# EAGLE design LeafCanV001 (EAGLE 6.1)

## Sheet 1 of 3
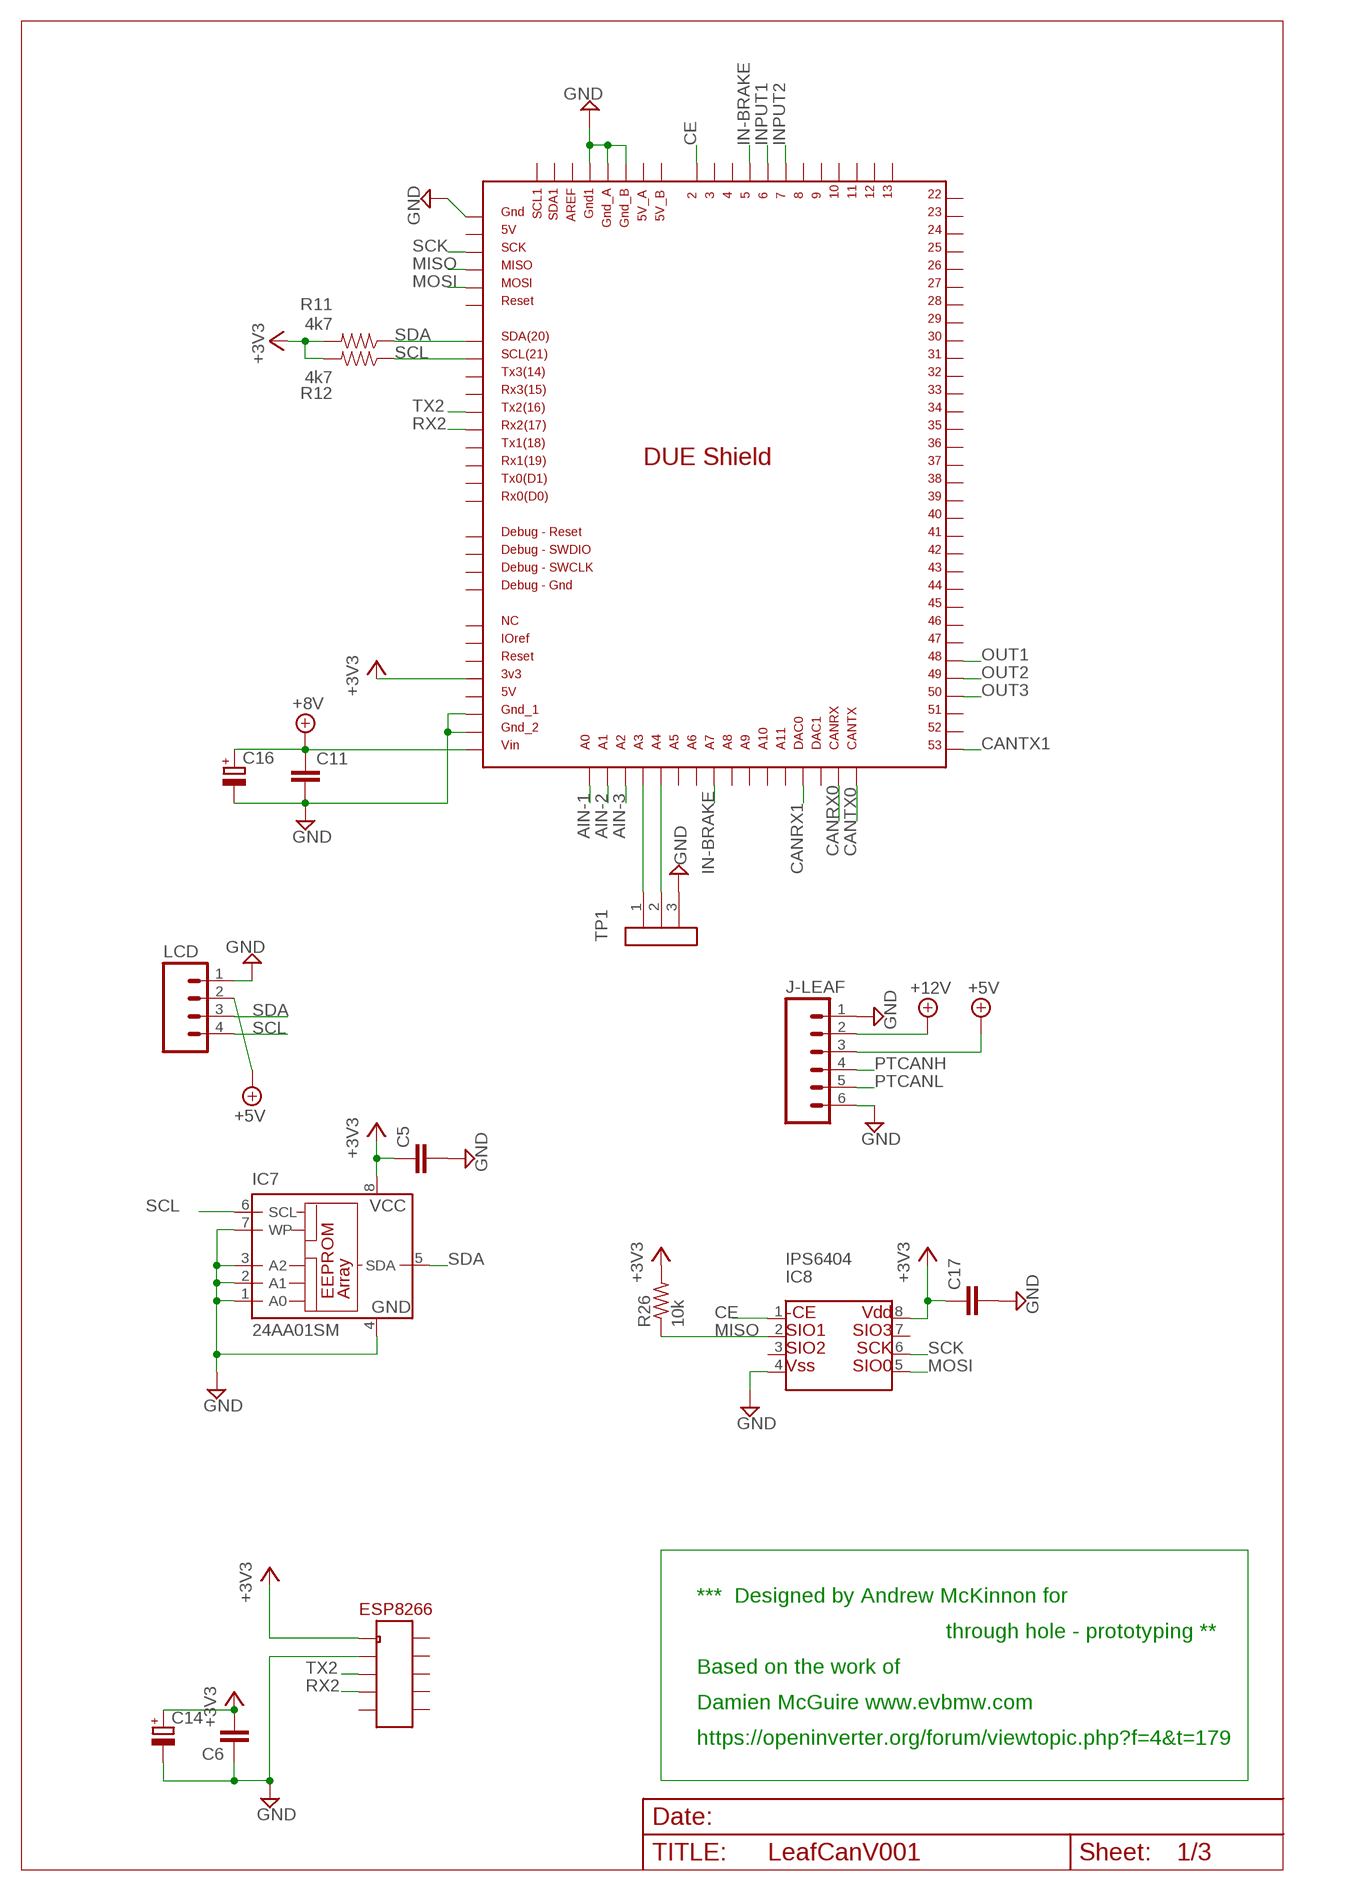
[diagram p0: schematic, sheet 1]

### Parts
C5  BCAP  [BCAP]
C6  BCAP  [BCAP]
C11  BCAP  [BCAP]
C14  C-RB200100  [CPOL-RADIAL-10UF-25V]
C16  C-RB200100  [CPOL-RADIAL-10UF-25V]
C17  BCAP  [BCAP]
ESP8266  IDC10  [IDC10-SMALL]
IC1  DUE(NORMAL)  [DUE(NORMAL)]
IC7  24AA01SM  [SO-08M]
IC8  IPS6404  [SO-08]
J-LEAF  MO6POL  [MOLEX-6]
LCD  MO4POL  [MOLEX-4]
R11  4k7  R4  [AXIAL-0.4]
R12  4k7  R4  [AXIAL-0.4]
R26  10k  R-US_R1206  [R1206]
TP1  SIL3  [SIL3]

### Nets
+3V3: C5.1 C6.2 C14.1(+) C17.1 ESP8266.1 IC1.3V3 IC7.8(VCC) IC8.8 R11.P$2 R12.P$2 R26.2 ; also sheet 2,3
+5V: J-LEAF.3 LCD.2 ; also sheet 3
+8V: C11.1 C16.1(+) IC1.VIN ; also sheet 3
+12V: J-LEAF.2 ; also sheet 2,3
AIN-1: IC1.A0 ; also sheet 3
AIN-2: IC1.A1 ; also sheet 3
AIN-3: IC1.A2 ; also sheet 3
CANRX0: IC1.CANRX ; also sheet 3
CANRX1: IC1.DAC0 ; also sheet 3
CANTX0: IC1.CANTX ; also sheet 3
CANTX1: IC1.53 ; also sheet 3
CE: IC1.2 IC8.1
GND: C5.2 C6.1 C11.2 C14.2(-) C16.2(-) C17.2 ESP8266.3 IC1.5V_ICSP IC1.GND1 IC1.GND_1 IC1.GND_2 IC1.GND_A IC1.GND_B IC7.1(A0) IC7.2(A1) IC7.3(A2) IC7.4(GND) IC7.7(WP) IC8.4 J-LEAF.1 J-LEAF.6 LCD.1 TP1.3 ; also sheet 2,3
IN-BRAKE: IC1.5 IC1.A7 ; also sheet 2
INPUT1: IC1.6 ; also sheet 2
INPUT2: IC1.7 ; also sheet 2
MISO: IC1.MISO_ICSP IC8.2 R26.1
MOSI: IC1.MOSI_ICSP IC8.5
N$20: IC1.A3 TP1.1
N$21: IC1.A4 TP1.2
OUT1: IC1.48 ; also sheet 2
OUT2: IC1.49 ; also sheet 2
OUT3: IC1.50 ; also sheet 2
PTCANH: J-LEAF.4 ; also sheet 3
PTCANL: J-LEAF.5 ; also sheet 3
RX2: ESP8266.7 IC1.RX2
SCK: IC1.SCK_ICSP IC8.6
SCL: IC1.SCL IC7.6(SCL) LCD.4 R12.P$1
SDA: IC1.SDA IC7.5(SDA) LCD.3 R11.P$1
TX2: ESP8266.5 IC1.TX2
Unconnected: ESP8266.2 ESP8266.4 ESP8266.6 ESP8266.8 ESP8266.9 ESP8266.10 IC1.3 IC1.4 IC1.5V IC1.5V_A IC1.5V_B IC1.8 IC1.9 IC1.10 IC1.11 IC1.12 IC1.13 IC1.22 IC1.23 IC1.24 IC1.25 IC1.26 IC1.27 IC1.28 IC1.29 IC1.30 IC1.31 IC1.32 IC1.33 IC1.34 IC1.35 IC1.36 IC1.37 IC1.38 IC1.39 IC1.40 IC1.41 IC1.42 IC1.43 IC1.44 IC1.45 IC1.46 IC1.47 IC1.51 IC1.52 IC1.A5 IC1.A6 IC1.A8 IC1.A9 IC1.A10 IC1.A11 IC1.AREF IC1.DAC1 IC1.GND_DEBUG IC1.GND_ICSP IC1.IOREF IC1.NC IC1.RESET IC1.RESET_DEBUG IC1.RESET_ICSP IC1.RX0 IC1.RX1 IC1.RX3 IC1.SCL1 IC1.SDA1 IC1.SWCLK_DEBUG IC1.SWDIO_DEBUG IC1.TX0 IC1.TX1 IC1.TX3 IC8.3 IC8.7

### Notes on the sheet
- ***  Designed by Andrew McKinnon for
- through hole - prototyping **
- Based on the work of
- Damien McGuire www.evbmw.com
- https://openinverter.org/forum/viewtopic.php?f=4&t=179

## Sheet 2 of 3
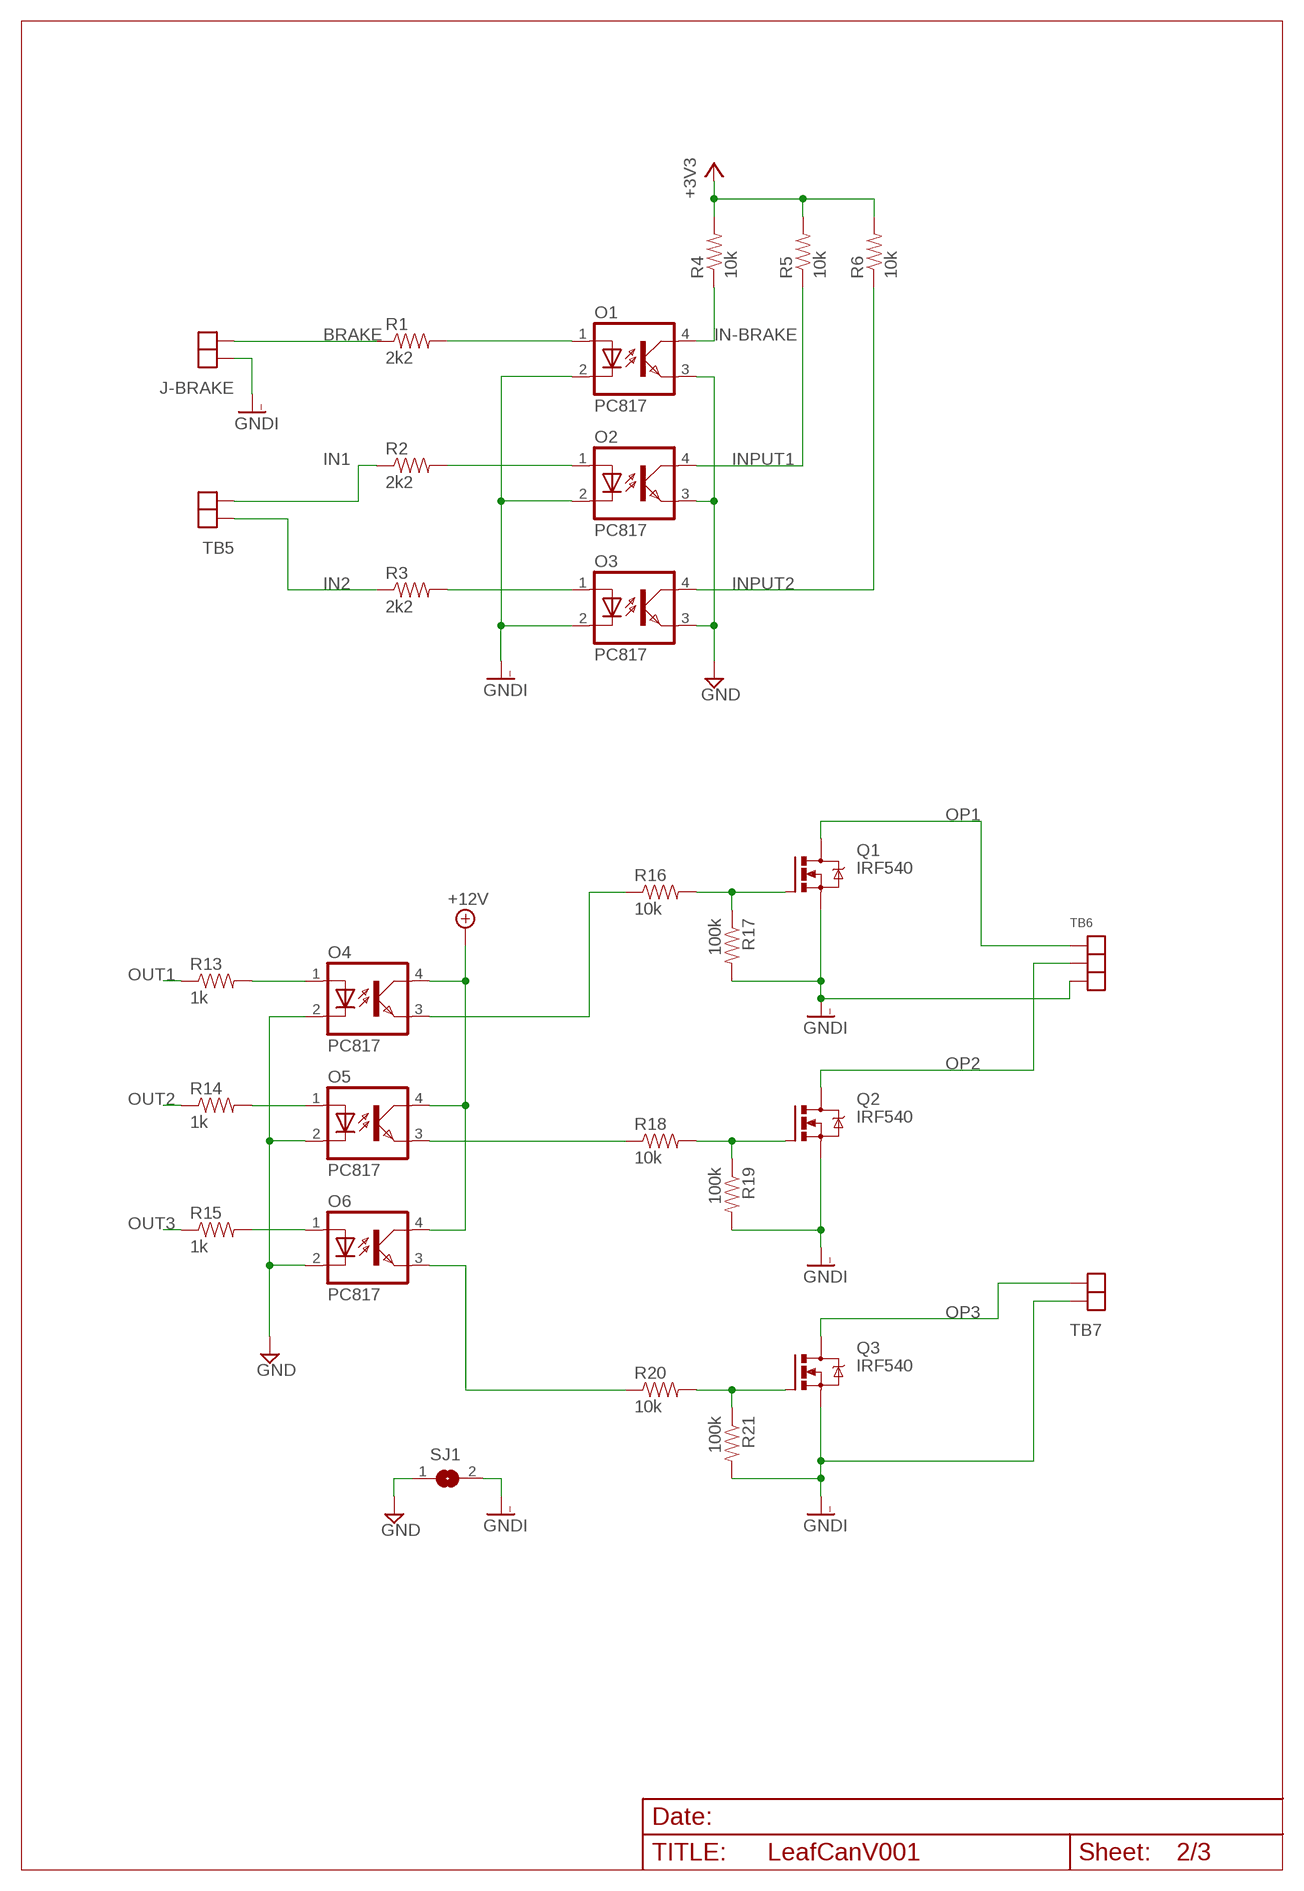
[diagram p1: schematic, sheet 2]

### Parts
J-BRAKE  TB2381  [TB-KF2EDG381-2P]
O1  PC817  [DIL04]
O2  PC817  [DIL04]
O3  PC817  [DIL04]
O4  PC817  [DIL04]
O5  PC817  [DIL04]
O6  PC817  [DIL04]
Q1  IRF540  [TO220BV]
Q2  IRF540  [TO220BV]
Q3  IRF540  [TO220BV]
R1  2k2  R4  [AXIAL-0.4]
R2  2k2  R4  [AXIAL-0.4]
R3  2k2  R4  [AXIAL-0.4]
R4  10k  R4  [AXIAL-0.4]
R5  10k  R4  [AXIAL-0.4]
R6  10k  R4  [AXIAL-0.4]
R13  1k  R4  [AXIAL-0.4]
R14  1k  R4  [AXIAL-0.4]
R15  1k  R4  [AXIAL-0.4]
R16  10k  R4  [AXIAL-0.4]
R17  100k  R4  [AXIAL-0.4]
R18  10k  R4  [AXIAL-0.4]
R19  100k  R4  [AXIAL-0.4]
R20  10k  R4  [AXIAL-0.4]
R21  100k  R4  [AXIAL-0.4]
SJ1  SJ  [SJ]
TB5  TB2381  [TB-KF2EDG381-2P]
TB6  TB3381  [TB-KF2EDG381-3P]
TB7  TB2381  [TB-KF2EDG381-2P]

### Nets
+3V3: R4.P$2 R5.P$2 R6.P$2 ; also sheet 1,3
+12V: O4.4(COL) O5.4(COL) O6.4(COL) ; also sheet 1,3
BRAKE: J-BRAKE.1 R1.P$1
GND: O1.3(EMIT) O2.3(EMIT) O3.3(EMIT) O4.2(C) O5.2(C) O6.2(C) SJ1.1 ; also sheet 1,3
GNDI: J-BRAKE.2 O1.2(C) O2.2(C) O3.2(C) Q1.S Q2.S Q3.S R17.P$2 R19.P$2 R21.P$2 SJ1.2 TB6.3 TB7.2
IN1: R2.P$1 TB5.1
IN2: R3.P$1 TB5.2
IN-BRAKE: O1.4(COL) R4.P$1 ; also sheet 1
INPUT1: O2.4(COL) R5.P$1 ; also sheet 1
INPUT2: O3.4(COL) R6.P$1 ; also sheet 1
N$1: Q1.G R16.P$2 R17.P$1
N$2: O3.1(A) R3.P$2
N$3: O2.1(A) R2.P$2
N$4: O1.1(A) R1.P$2
N$11: Q2.G R18.P$2 R19.P$1
N$12: Q3.G R20.P$2 R21.P$1
N$13: O4.1(A) R13.P$2
N$14: O5.1(A) R14.P$2
N$15: O6.1(A) R15.P$2
N$16: O6.3(EMIT) R20.P$1
N$17: O5.3(EMIT) R18.P$1
N$18: O4.3(EMIT) R16.P$1
OP1: Q1.D TB6.1
OP2: Q2.D TB6.2
OP3: Q3.D TB7.1
OUT1: R13.P$1 ; also sheet 1
OUT2: R14.P$1 ; also sheet 1
OUT3: R15.P$1 ; also sheet 1

## Sheet 3 of 3
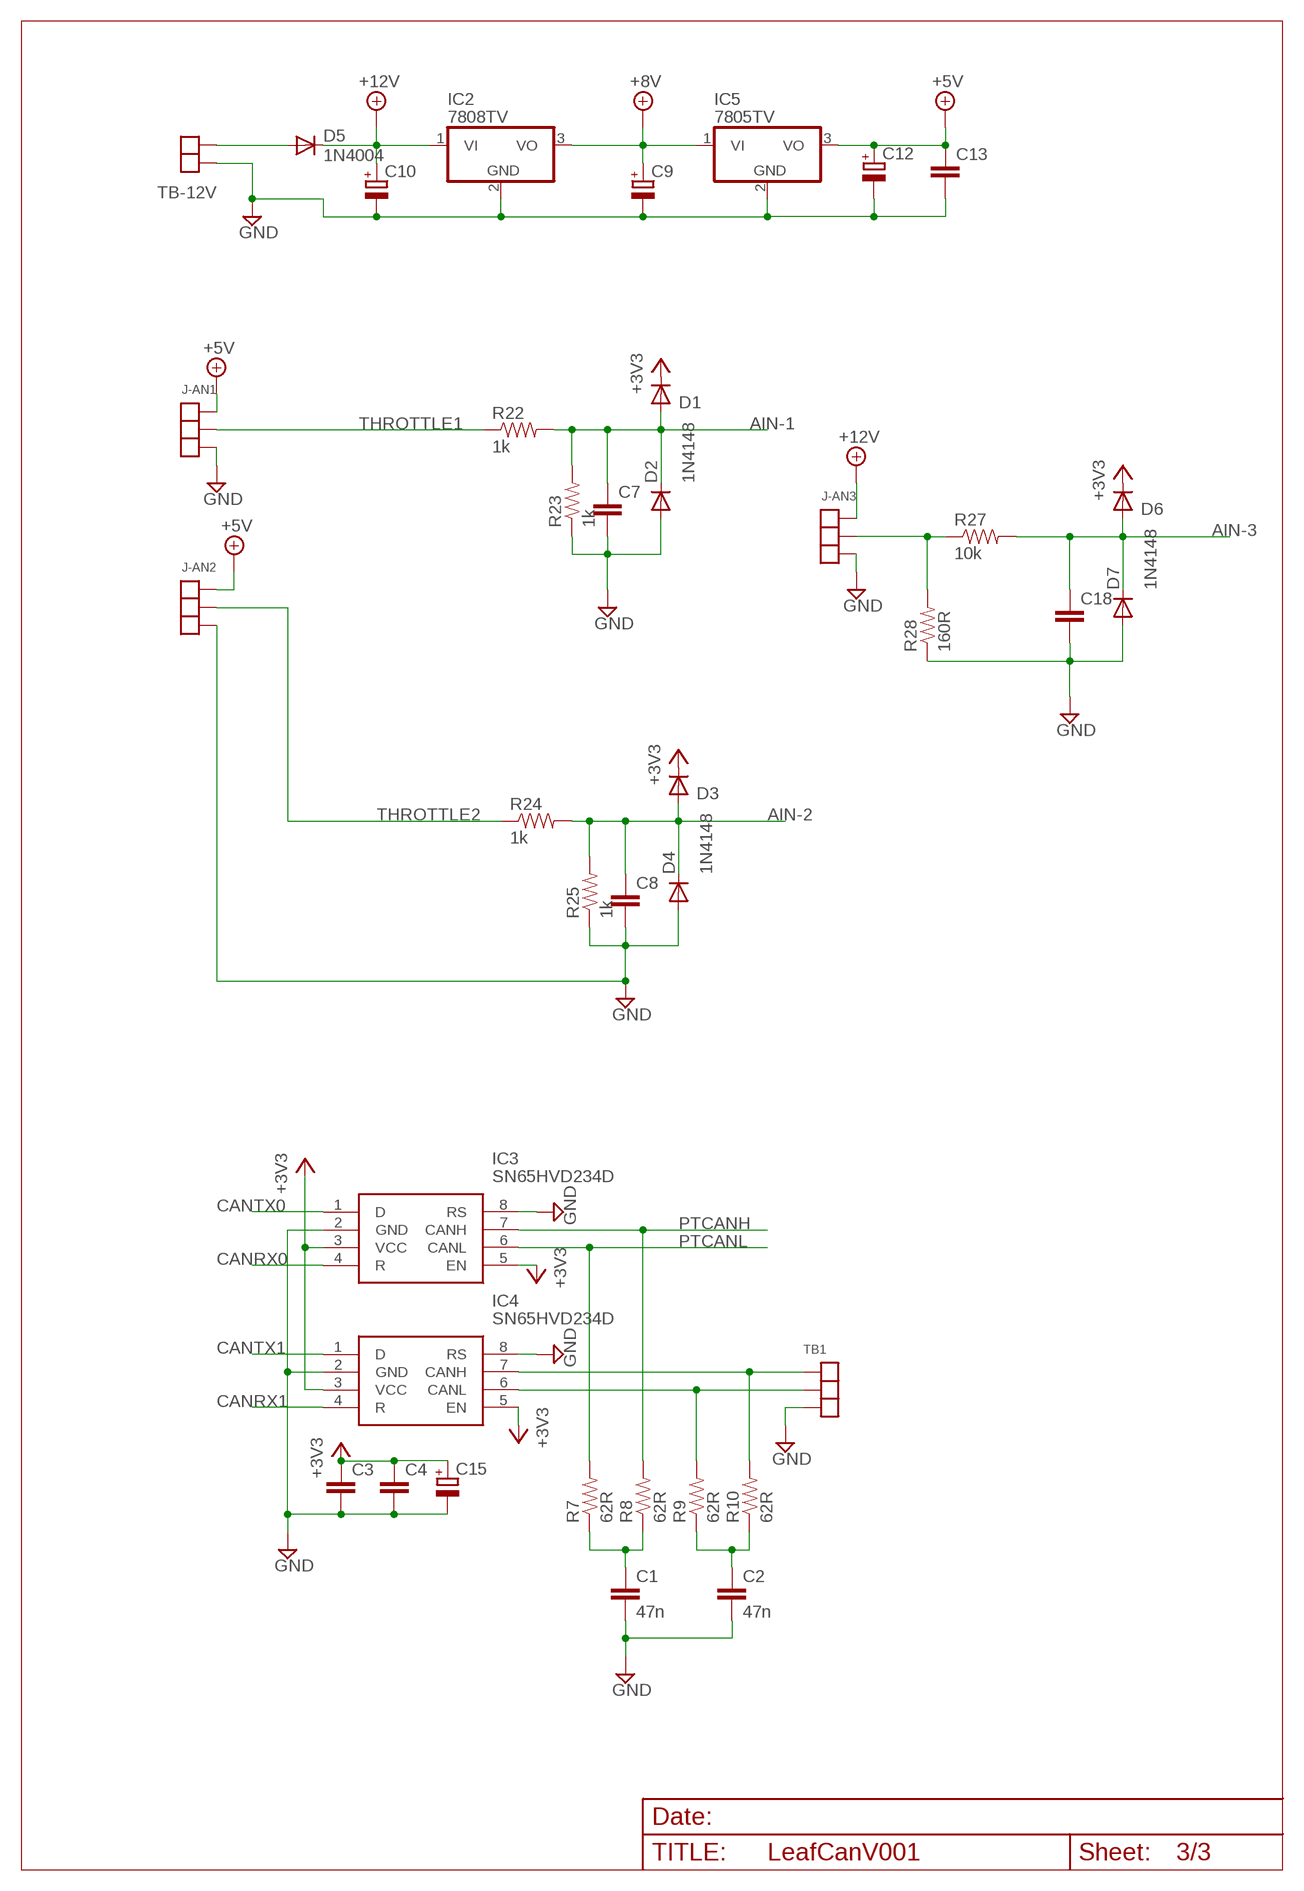
[diagram p2: schematic, sheet 3]

### Parts
C1  47n  C-EU025-030X050  [C025-030X050]
C2  47n  C-EU025-030X050  [C025-030X050]
C3  BCAP  [BCAP]
C4  BCAP  [BCAP]
C7  BCAP  [BCAP]
C8  BCAP  [BCAP]
C9  C-RB200100  [CPOL-RADIAL-10UF-25V]
C10  CPOL-EUE7.5-18  [E7,5-18]
C12  C-RB200100  [CPOL-RADIAL-10UF-25V]
C13  BCAP  [BCAP]
C15  C-RB200100  [CPOL-RADIAL-10UF-25V]
C18  BCAP  [BCAP]
D1  1N4148  1N4148DO35-7  [D3]
D2  1N4148  1N4148DO35-7  [D3]
D3  1N4148  1N4148DO35-7  [D3]
D4  1N4148  1N4148DO35-7  [D3]
D5  1N4004  [DO41-10]
D6  1N4148  1N4148DO35-7  [D3]
D7  1N4148  1N4148DO35-7  [D3]
IC2  7808TV  [TO220V]
IC3  SN65HVD234D  [SOIC127P600X175-8N]
IC4  SN65HVD234D  [SOIC127P600X175-8N]
IC5  7805TV  [TO220V]
J-AN1  TB3381V  [TB-KF2EDG381-3-V]
J-AN2  TB3381V  [TB-KF2EDG381-3-V]
J-AN3  TB3381V  [TB-KF2EDG381-3-V]
R7  62R  R4  [AXIAL-0.4]
R8  62R  R4  [AXIAL-0.4]
R9  62R  R4  [AXIAL-0.4]
R10  62R  R4  [AXIAL-0.4]
R22  1k  R4  [AXIAL-0.4]
R23  1k  R4  [AXIAL-0.4]
R24  1k  R4  [AXIAL-0.4]
R25  1k  R4  [AXIAL-0.4]
R27  10k  R4  [AXIAL-0.4]
R28  160R  R4  [AXIAL-0.4]
TB1  TB3381V  [TB-KF2EDG381-3-V]
TB-12V  TB2381  [TB-KF2EDG381-2P]

### Nets
+3V3: C3.1 C4.1 C15.1(+) D1.C D3.C D6.C IC3.3(VCC) IC3.5(EN) IC4.3(VCC) IC4.5(EN) ; also sheet 1,2
+5V: C12.1(+) C13.1 IC5.3(VO) J-AN1.1 J-AN2.1 ; also sheet 1
+8V: C9.1(+) IC2.3(VO) IC5.1(VI) ; also sheet 1
+12V: C10.+ D5.C IC2.1(VI) J-AN3.1 ; also sheet 1,2
AIN-1: C7.1 D1.A D2.C R22.P$2 R23.P$2 ; also sheet 1
AIN-2: C8.1 D3.A D4.C R24.P$2 R25.P$2 ; also sheet 1
AIN-3: C18.1 D6.A D7.C R27.P$2 ; also sheet 1
CANRX0: IC3.4(R) ; also sheet 1
CANRX1: IC4.4(R) ; also sheet 1
CANTX0: IC3.1(D) ; also sheet 1
CANTX1: IC4.1(D) ; also sheet 1
GND: C1.2 C2.2 C3.2 C4.2 C7.2 C8.2 C9.2(-) C10.- C12.2(-) C13.2 C15.2(-) C18.2 D2.A D4.A D7.A IC2.2(GND) IC3.2(GND) IC3.8(RS) IC4.2(GND) IC4.8(RS) IC5.2(GND) J-AN1.3 J-AN2.3 J-AN3.3 R23.P$1 R25.P$1 R28.P$1 TB1.3 TB-12V.2 ; also sheet 1,2
N$5: C1.1 R7.P$1 R8.P$1
N$6: C2.1 R9.P$1 R10.P$1
N$8: J-AN3.2 R27.P$1 R28.P$2
N$9: IC4.7(CANH) R10.P$2 TB1.1
N$10: IC4.6(CANL) R9.P$2 TB1.2
N$19: D5.A TB-12V.1
PTCANH: IC3.7(CANH) R8.P$2 ; also sheet 1
PTCANL: IC3.6(CANL) R7.P$2 ; also sheet 1
THROTTLE1: J-AN1.2 R22.P$1
THROTTLE2: J-AN2.2 R24.P$1

## Library data of the parts
C1 C2 = rcl:C-EU: CAPACITOR, European symbol
C3-C8 C11 C13 C17 C18 = Andrew Misc:BCAP
C9 C12 = Andrew:C-RB200100
C10 = rcl:CPOL-EU: POLARIZED CAPACITOR, European symbol
C14-C16 = Andrew Passive:C-RB200100
D1-D4 D6 D7 = Andrew Misc:1N4148: DIODE high speed (Philips)
D5 = diode:1N4004: DIODE general purpose rectifier, 1 A
ESP8266 = Andrew_Connectors:IDC10
IC1 = DUElib130425:DUE(NORMAL)
IC2 IC5 = Andrew Linear:78*: Positive VOLTAGE REGULATOR Source: http://cache.national.com/ds/LM/LM78L05.pdf http://www.fairchildsemi.com/ds/LM/LM7805.pdf
IC3 IC4 = SN65HVD234D:SN65HVD234D: 3.3 V CAN Transceiver with Sleep Mode Source: Datasheet <http://www.ti.com/lit/gpn/sn65hvd234>; DESCRIPTION: 3.3 V CAN Transceiver with Sleep Mode; HEIGHT: 1.75mm; MANUFACTURER_NAME: Texas Instruments; MANUFACTURER_PART_NUMBER: SN65HVD234D; MOUSER_PART_NUMBER: 595-SN65HVD234D; MOUSER_PRICE-STOCK: https://www.mouser.com/Search/Refine.aspx?Keyword=595-SN65HVD234D; RS_PART_NUMBER: 6624315P; RS_PRICE-STOCK: http://uk.rs-online.com/web/p/products/6624315P
IC7 = microchip:24*: Serial EEPROM I2C; MF: MICROCHIP; MPN: 24AA01-I/SN; OC_FARNELL: 1331268; OC_NEWARK: 92C6793
IC8 = Andrew IC:IPS6404
J-AN1-J-AN3 TB1 TB6 = Andrew_Connectors:TB3
J-BRAKE TB5 TB7 TB-12V = Andrew_Connectors:TB2
J-LEAF = Andrew_Connectors:MO6POL
LCD = Andrew_Connectors:MO4POL
O1-O6 = Andrew:PC817: SHARP OPTO COUPLER; MPN: PC817X4J000F; OC_FARNELL: 9707727; OC_NEWARK: 97K7059
Q1-Q3 = Andrew Misc:IRF540: HEXFET Power MOSFET
R1-R25 R27 R28 = Andrew Misc:R4
R26 = rcl:R-US_: RESISTOR, American symbol
SJ1 = jumper:SJ: SMD solder JUMPER
TP1 = Andrew_Connectors:SIL3

## Board
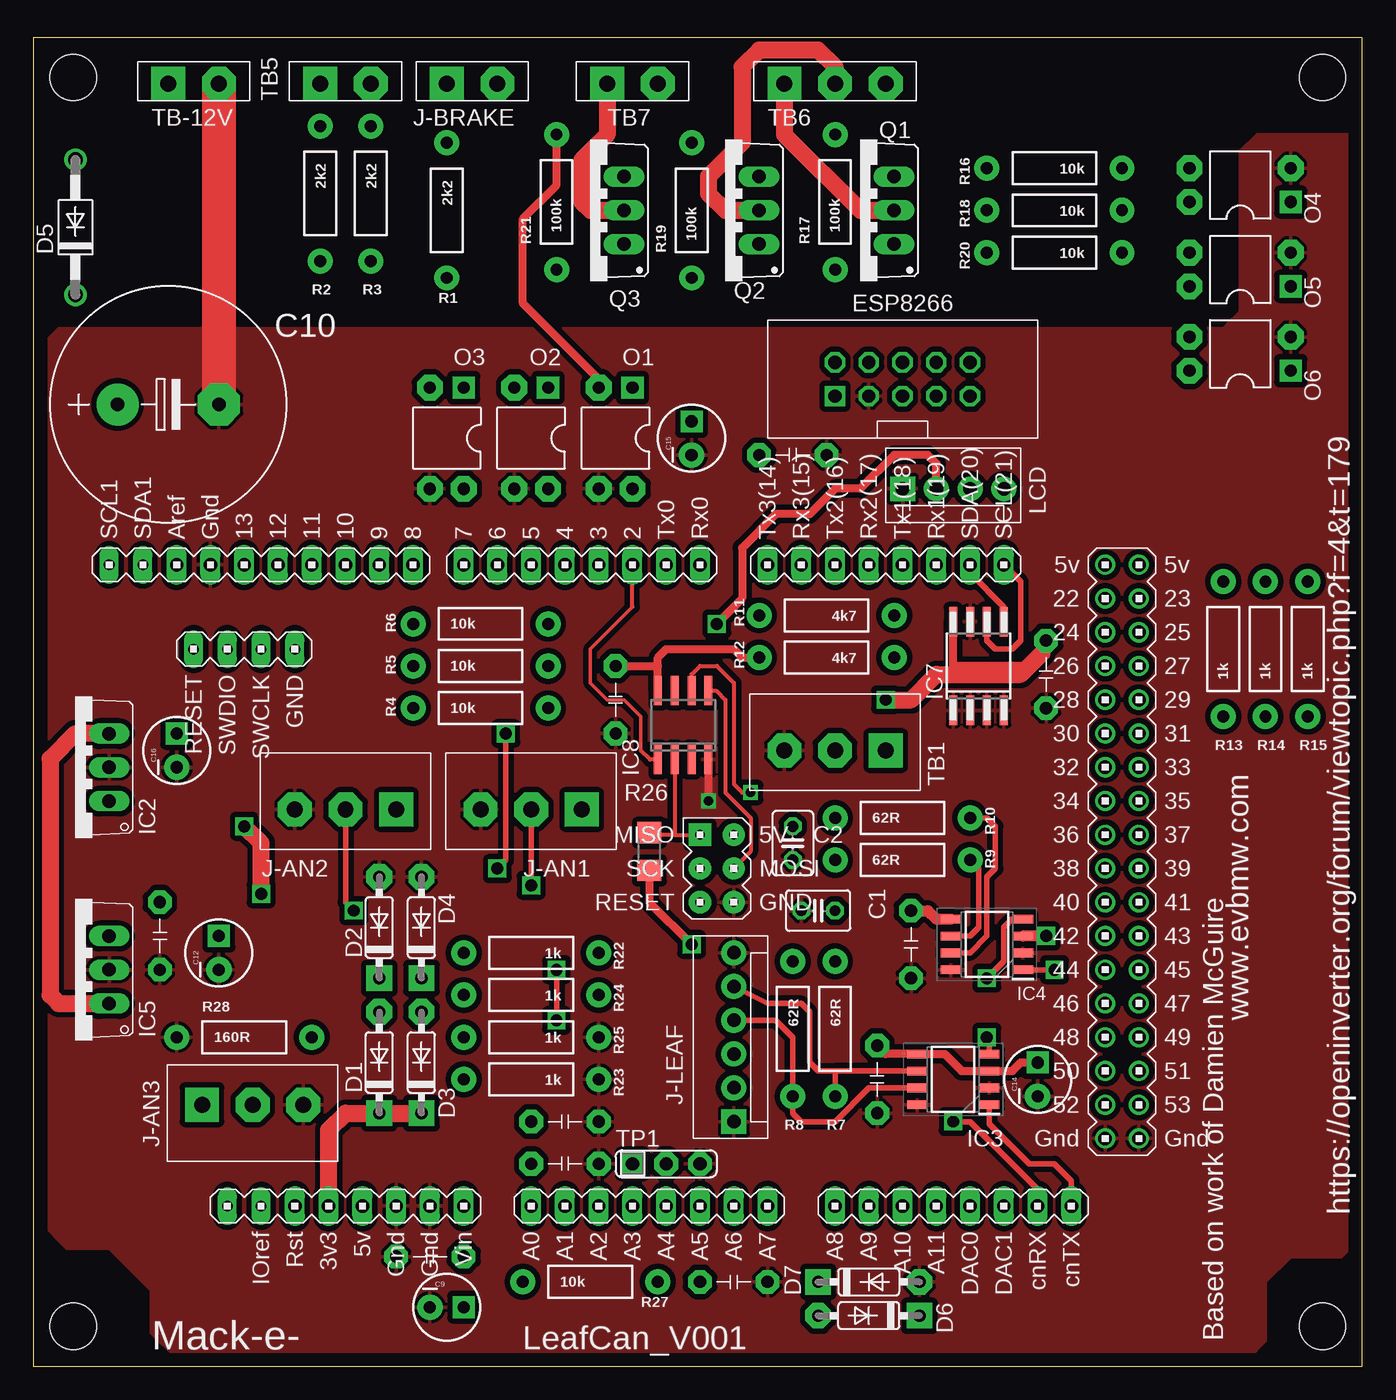
[diagram p3: board, top side]
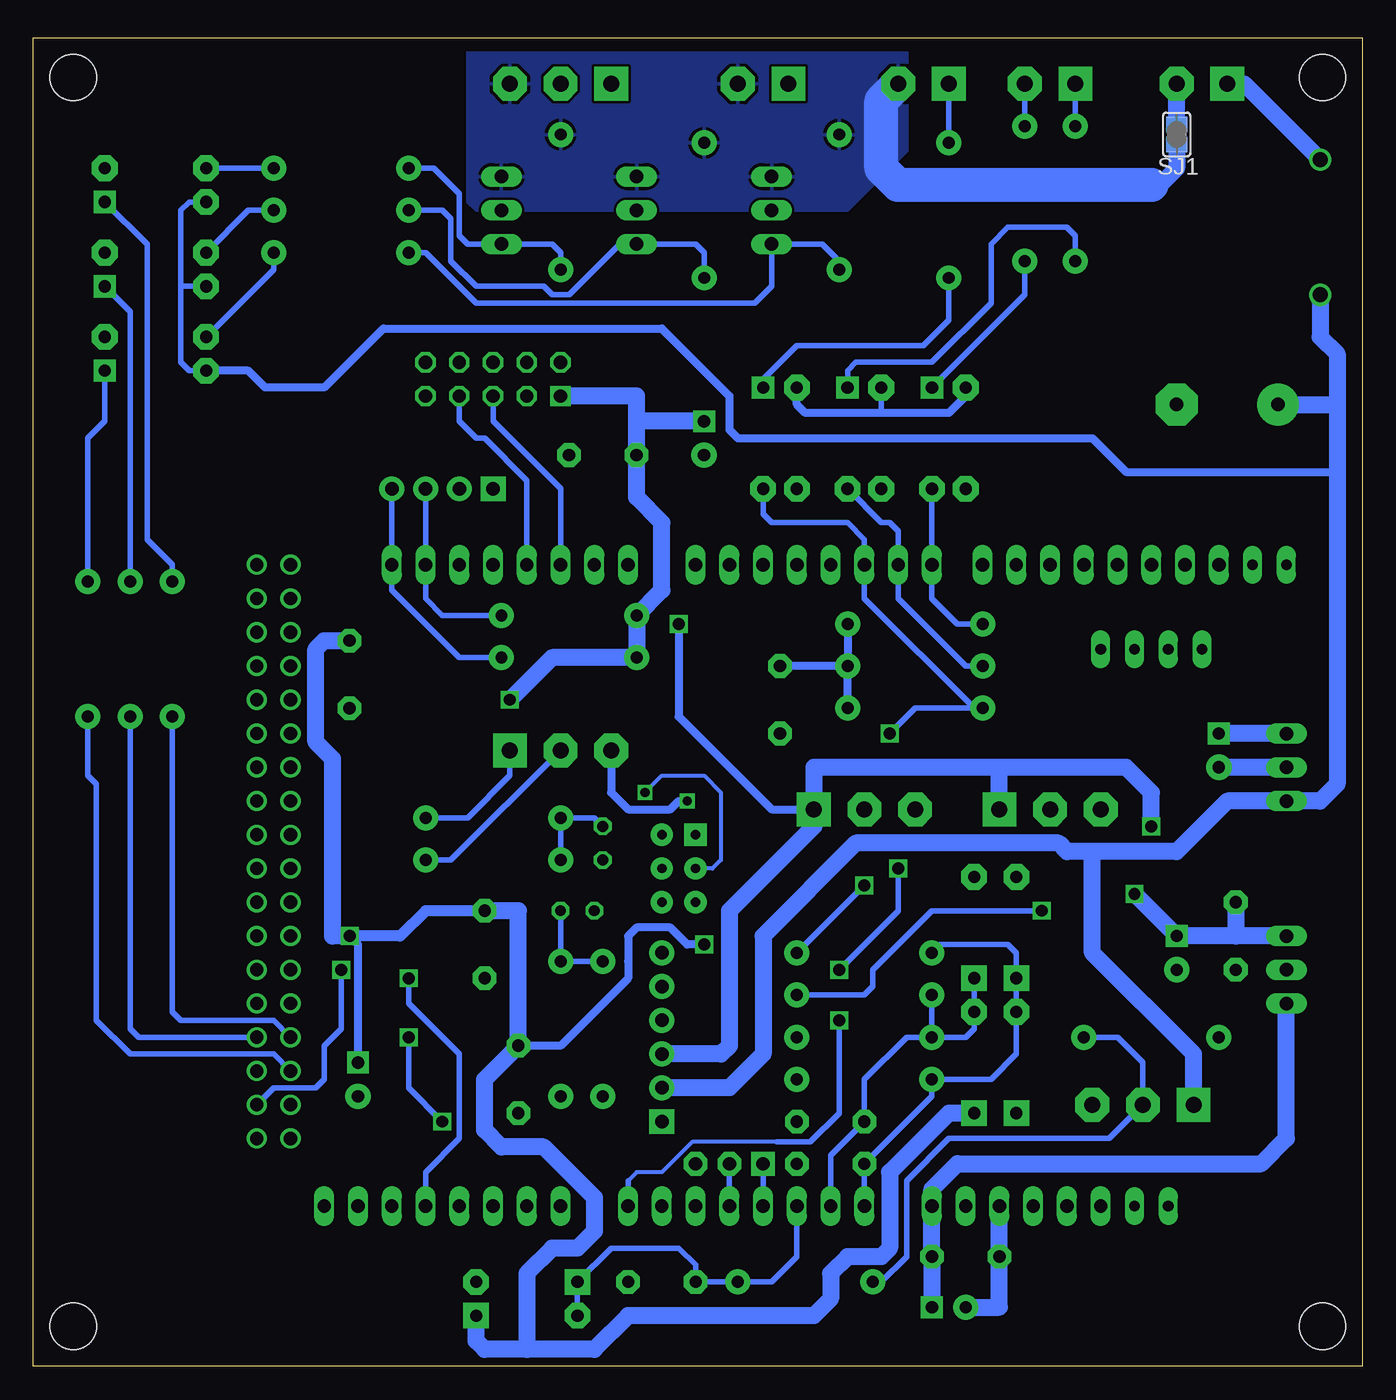
[diagram p4: board, bottom side, seen from below]

Size 100 x 100 mm. Coordinates in mm from the lower left corner, seen from the top.
Outline: 0,0 100,0 100,100 0,100 0,0
Copper layers (1*16): Top 0.035mm / dielectric 1.5mm / Bottom 0.035mm
Design rules: minimum track width 10mil, minimum drill 24mil, track to track 8mil, track to pad 8mil, pad to pad 8mil, via to via 8mil, smd to smd 8mil, copper to edge 40mil, drill to drill 8mil, minimum pad ring 10mil, minimum via ring 8mil, stop-mask expansion 4mil, vias tented up to drill 0mil, thermal gap 10mil
Holes 3.5 mm at 3,3 3,97 97,97 97,3

### Footprints (pad centres in the part's own frame; a part is rotated, then mirrored left to right if it is on the bottom)
C025-030X050 = drill 0.813 octagon: 1 -1.27,0; 2 1.27,0
BCAP = drill 0.914 pad 1.778 octagon: 1 -2.54,0; 2 2.54,0
CPOL-RADIAL-10UF-25V = drill 0.914 pad 1.651 square: 1 1.27,0 | drill 0.914 pad 1.905: 2 -1.27,0
E7,5-18 = drill 1.016 pad 3.15: + -3.81,0 | drill 1.016 pad 3.15 octagon: - 3.81,0
D3 = drill 0.914 pad 1.93 octagon: A 3.81,0 | drill 0.914 pad 1.93 square: C -3.81,0
DO41-10 = drill 1.118: A 5.08,0; C -5.08,0
IDC10-SMALL = drill 1 pad 1.524 square: 1 -5.08,-1.27 | drill 1 pad 1.524 octagon: 2 -5.08,1.27; 3 -2.54,-1.27; 4 -2.54,1.27; 5 0,-1.27; 6 0,1.27; 7 2.54,-1.27; 8 2.54,1.27; 9 5.08,-1.27; 10 5.08,1.27
DUE(NORMAL) = drill 1 long: 2 -16.51,30.48; 3 -19.05,30.48; 3V3 -39.37,-17.78; 4 -21.59,30.48; 5 -24.13,30.48; 5V -36.83,-17.78; 6 -26.67,30.48; 7 -29.21,30.48; 8 -33.02,30.48; 9 -35.56,30.48; 10 -38.1,30.48; 11 -40.64,30.48; 12 -43.18,30.48; 13 -45.72,30.48; A0 -24.13,-17.78; A1 -21.59,-17.78; A2 -19.05,-17.78; A3 -16.51,-17.78; A4 -13.97,-17.78; A5 -11.43,-17.78; A6 -8.89,-17.78; A7 -6.35,-17.78; A8 -1.27,-17.78; A9 1.27,-17.78; A10 3.81,-17.78; A11 6.35,-17.78; AREF -50.8,30.48; AREF1 -50.8,30.48; CANRX 13.97,-17.78; CANTX 16.51,-17.78; DAC0 8.89,-17.78; DAC1 11.43,-17.78; GND1 -48.26,30.48; GND_1 -34.29,-17.78; GND_2 -31.75,-17.78; RESET -41.91,-17.78; RX0 -11.43,30.48; RX1 6.35,30.48; RX2 1.27,30.48; RX3 -3.81,30.48; SCL 11.43,30.48; SDA 8.89,30.48; TX0 -13.97,30.48; TX1 3.81,30.48; TX2 -1.27,30.48; TX3 -6.35,30.48; VIN -29.21,-17.78 | drill 1: 5V_A 19.05,30.48; 5V_B 21.59,30.48; 22 19.05,27.94; 23 21.59,27.94; 24 19.05,25.4; 25 21.59,25.4; 26 19.05,22.86; 27 21.59,22.86; 28 19.05,20.32; 29 21.59,20.32; 30 19.05,17.78; 31 21.59,17.78; 32 19.05,15.24; 33 21.59,15.24; 34 19.05,12.7; 35 21.59,12.7; 36 19.05,10.16; 37 21.59,10.16; 38 19.05,7.62; 39 21.59,7.62; 40 19.05,5.08; 41 21.59,5.08; 42 19.05,2.54; 43 21.59,2.54; 44 19.05,0; 45 21.59,0; 46 19.05,-2.54; 47 21.59,-2.54; 48 19.05,-5.08; 49 21.59,-5.08; 50 19.05,-7.62; 51 21.59,-7.62; 52 19.05,-10.16; 53 21.59,-10.16; GND_A 19.05,-12.7; GND_B 21.59,-12.7 | drill 0.7 pad 1.676: 5V_ICSP -8.89,5.08; GND_ICSP -8.89,10.16; MOSI_ICSP -8.89,7.62; RESET_ICSP -11.43,5.08; SCK_ICSP -11.43,7.62 | drill 0.8 pad 1.422 long: GND_DEBUG -41.91,24.13; IOREF -44.45,-17.78; NC -46.99,-17.78; RESET_DEBUG -49.53,24.13; SCL1 -55.88,30.48; SDA1 -53.34,30.48; SWCLK_DEBUG -44.45,24.13; SWDIO_DEBUG -46.99,24.13 | drill 0.7 pad 1.676 square: MISO_ICSP -11.43,10.16
TO220V = drill 1.016 long: 1 -2.54,-2.54; 2 0,-2.54; 3 2.54,-2.54
SOIC127P600X175-8N = smd 1.528 x 0.65: 1 -2.711,1.905; 2 -2.711,0.635; 3 -2.711,-0.635; 4 -2.711,-1.905; 5 2.711,-1.905; 6 2.711,-0.635; 7 2.711,0.635; 8 2.711,1.905
SO-08M = smd 0.6 x 2.2: 1 -1.905,-3.33; 2 -0.635,-3.33; 3 0.635,-3.33; 4 1.905,-3.33; 5 1.905,3.33; 6 0.635,3.33; 7 -0.635,3.33; 8 -1.905,3.33
SO-08 = smd 0.6 x 2.2: 1 -1.905,-2.6; 2 -0.635,-2.6; 3 0.635,-2.6; 4 1.905,-2.6; 5 1.905,2.6; 6 0.635,2.6; 7 -0.635,2.6; 8 -1.905,2.6
TB-KF2EDG381-3-V = drill 1.2 pad 2.54 square: 1 0,0 | drill 1.2 pad 2.54 octagon: 2 3.81,0; 3 7.62,0
TB-KF2EDG381-2P = drill 1.2 pad 2.54 square: 1 0,0 | drill 1.2 pad 2.54 octagon: 2 3.81,0
MOLEX-6 = drill 1.016 pad 1.88 square: 1 -6.35,0 | drill 1.016 pad 1.88: 2 -3.81,0; 3 -1.27,0; 4 1.27,0; 5 3.81,0; 6 6.35,0
MOLEX-4 = drill 1.016 pad 1.88 square: 1 -3.81,0 | drill 1.016 pad 1.88: 2 -1.27,0; 3 1.27,0; 4 3.81,0
DIL04 = drill 0.914 pad 1.676 square: 1 -1.27,-3.81 | drill 0.914 pad 1.93 octagon: 2 1.27,-3.81; 3 1.27,3.81; 4 -1.27,3.81
TO220BV = drill 1.016 long: D 0,-2.54; G -2.54,-2.54; S 2.54,-2.54
AXIAL-0.4 = drill 0.9 pad 1.88: P$1 -5.08,0; P$2 5.08,0
R1206 = smd 1.6 x 1.803: 1 -1.422,0; 2 1.422,0
SJ = smd 1.168 x 1.6: 1 -0.762,0; 2 0.762,0
TB-KF2EDG381-3P = drill 1.2 pad 2.54 square: 1 0,0 | drill 1.2 pad 2.54 octagon: 2 3.81,0; 3 7.62,0
SIL3 = drill 1 pad 1.778 square: 1 0,0 | drill 1 pad 1.778 octagon: 2 2.54,0; 3 5.08,0

### Placement (x,y rotation side)
C1  59.05,34.29 180 top
C2  57.15,39.37 270 top
C3  57.15,68.58 0 top
C4  66.04,31.75 270 top
C5  76.2,52.07 270 top
C6  63.5,21.59 90 top
C7  40.01,15.24 0 top
C8  40.01,18.41 0 top
C9  31.11,4.45 0 top
C10  10.16,72.39 0 top
C11  29.84,8.26 180 top
C12  13.97,31.11 90 top
C13  9.53,32.38 270 top
C14  75.56,21.59 90 top
C15  49.53,69.85 90 top
C16  10.79,46.35 90 top
C17  43.81,50.16 270 top
C18  52.7,6.35 0 top
D1  26.04,22.86 90 top
D2  26.04,33.02 90 top
D3  29.21,22.86 90 top
D4  29.21,33.02 90 top
D5  3.17,85.72 90 top
D6  62.87,3.81 180 top
D7  62.87,6.35 0 top
ESP8266  65.41,74.3 0 top
IC1  61.59,29.84 0 top
IC2  3.17,45.09 90 top
IC3  69.22,21.59 180 top
IC4  71.75,31.75 180 top
IC5  3.17,29.84 90 top
IC7  71.12,52.7 0 top
IC8  48.9,48.26 0 top
J-AN1  41.27,41.91 180 top
J-AN2  27.3,41.91 180 top
J-AN3  12.7,19.68 0 top
J-BRAKE  31.11,96.52 0 top
J-LEAF  52.7,24.77 90 top
LCD  69.22,66.04 0 top
O1  43.81,69.85 180 top
O2  37.47,69.85 180 top
O3  31.11,69.85 180 top
O4  90.81,88.9 90 top
O5  90.81,82.55 90 top
O6  90.81,76.2 90 top
Q1  62.23,87 90 top
Q2  52.07,87 90 top
Q3  41.91,87 90 top
R1  31.11,87 270 top
R2  21.59,88.27 270 top
R3  25.4,88.27 270 top
R4  33.66,49.53 0 top
R5  33.66,52.7 0 top
R6  33.66,55.88 0 top
R7  60.33,25.4 270 top
R8  57.15,25.4 270 top
R9  65.41,38.1 0 top
R10  65.41,41.27 0 top
R11  59.69,56.52 180 top
R12  59.69,53.34 180 top
R13  89.53,53.98 90 top
R14  92.71,53.98 90 top
R15  95.89,53.98 90 top
R16  76.83,90.17 180 top
R17  60.33,87.63 90 top
R18  76.83,87 180 top
R19  49.53,87 90 top
R20  76.83,83.82 180 top
R21  39.37,87.63 90 top
R22  37.47,31.11 180 top
R23  37.47,21.59 180 top
R24  37.47,27.94 180 top
R25  37.47,24.77 180 top
R26  46.35,38.73 270 top
R27  41.91,6.35 0 top
R28  15.88,24.77 0 top
SJ1  13.97,92.71 270 bottom
TB1  64.14,46.35 180 top
TB5  21.59,96.52 0 top
TB6  56.52,96.52 0 top
TB7  43.18,96.52 0 top
TB-12V  10.16,96.52 0 top
TP1  45.09,15.24 0 top

### Tracks (layer width: path | path; a pad name or v marks a point on that pad's centre or on a via)
+3V3  (via drill 0.9)
  Top 0.61: IC8.8 46.99,52.7 | 46.99,52.7 46.99,53.34 47.62,53.98 52.7,53.98 53.34,53.34 R12.P$2 | C17.1 46.99,52.7 | C6.2 64.14,23.5 IC3.5 68.58,23.5 69.85,22.23 IC3.3 73.66,22.23 74.3,22.86 C14.1 | C5.1 76.2,53.98 75.88,53.66 74.93,52.7 69.22,52.7 IC7.8 | R26.2 46.35,34.92 v49.53,31.75
  Top 0.813: C4.1 67.31,34.29 67.94,33.66 IC4.5 | v76.2,32.38 IC4.3
  Top 1.27: IC1.3V3 22.23,17.78 23.5,19.05 D1.C D3.C | v64.14,50.16 66.04,50.16 67.94,52.07 74.3,52.07 75.88,53.66
  Bottom 0.61: R4.P$2 R5.P$2 | R6.P$2 R5.P$2 | R5.P$2 C17.1 | v49.53,31.75 50.8,31.75 52.07,33.02 54.61,33.02 55.24,32.38 55.24,30.48 55.24,29.21 60.33,24.13 C6.2 | C14.1 75.56,31.75 v76.2,32.38
  Bottom 0.813: C4.1 70.48,34.29 72.39,32.38 v76.2,32.38
  Bottom 1.27: v76.2,32.38 77.47,32.38 77.47,45.72 78.74,46.99 78.74,53.98 78.11,54.61 C5.1 | v64.14,50.16 60.96,53.34 R12.P$2 R11.P$2 52.7,58.42 52.7,63.5 54.61,65.41 C3.1 54.61,71.12 | 54.61,71.12 54.61,73.03 ESP8266.1 | C15.1 54.61,71.12 | D3.C 31.11,19.05 35.56,14.61 35.56,8.89 36.2,8.26 38.73,8.26 40.01,6.99 40.01,5.08 41.27,3.81 55.24,3.81 57.78,1.27 62.87,1.27 | C4.1 63.5,34.29 C6.2 66.04,21.59 66.04,17.78 64.77,16.51 61.59,16.51 57.78,12.7 57.78,10.16 59.05,8.89 60.96,8.89 62.87,6.99 62.87,1.27 | 62.87,1.27 66.04,1.27 66.67,1.91 D6.C
+5V  (via drill 0.9)
  Top 0.61: LCD.2 67.94,67.94 67.31,68.58 64.77,68.58 62.23,66.04 60.33,66.04 58.42,64.14 55.88,64.14 53.34,61.59 53.34,57.78 v51.44,55.88
  Top 1.27: v17.14,35.56 17.14,39.37 v15.88,40.64
  Bottom 0.61: v51.44,55.88 51.44,48.9 44.45,41.91 J-AN1.1
  Bottom 1.27: IC5.3 9.53,32.38 | 9.53,32.38 C12.1 v17.14,35.56 | C13.1 9.53,32.38 | v15.88,40.64 15.88,43.18 17.78,45.09 27.3,45.09 | 27.3,45.09 41.27,45.09 J-AN1.1 41.27,40.64 47.62,34.29 47.62,24.13 48.26,23.5 J-LEAF.3 | J-AN2.1 27.3,45.09
+8V
  Top 1.27: IC2.3 3.17,47.62 1.27,45.72 1.27,27.94 1.91,27.3 IC5.1
  Bottom 1.27: IC2.3 C16.1 | IC5.1 5.71,17.14 7.62,15.24 30.48,15.24 32.38,13.34 IC1.VIN C11.1 C9.1
+12V
  Bottom 0.406: O4.4 88.27,87.63 88.9,87 88.9,81.28 | 88.9,81.28 88.9,75.56 88.27,74.93 O6.4 | O5.4 88.9,81.28
  Bottom 0.61: 1.91,67.31 17.78,67.31 20.32,69.85 46.99,69.85 47.62,70.48 47.62,73.03 52.7,78.11 73.66,78.11 78.11,73.66 82.55,73.66 83.82,74.93 O6.4
  Bottom 1.27: D5.C 3.17,77.47 1.91,76.2 1.91,72.39 | 1.91,72.39 1.91,67.31 1.91,43.81 3.17,42.55 IC2.1 10.16,42.55 13.97,38.73 20.32,38.73 | C10.+ 1.91,72.39 | 20.32,38.73 22.23,38.73 22.86,39.37 38.1,39.37 45.09,32.38 45.09,23.5 47.62,20.95 J-LEAF.2 | J-AN3.1 12.7,23.5 20.32,31.11 20.32,38.73
AIN-1
  Bottom 0.406: IC1.A0 C7.1 32.38,20.32 R23.P$2 27.94,21.59 26.04,23.5 D1.A D2.C 26.04,31.11 26.67,31.75 31.75,31.75 R22.P$2
AIN-2
  Bottom 0.406: IC1.A1 40.01,15.88 C8.1 37.47,21.59 34.29,24.77 R25.P$2 | D4.C D3.A 29.21,25.4 29.84,24.77 R25.P$2 | R25.P$2 R24.P$2
AIN-3
  Bottom 0.406: IC1.A2 42.55,8.26 44.45,6.35 R27.P$2 C18.1 50.16,7.62 51.44,8.89 56.52,8.89 D7.C D6.A
BRAKE
  Bottom 0.406: R1.P$1 J-BRAKE.1
CANRX0  (via drill 0.9)
  Top 0.406: IC3.4 71.93,24.59 v71.75,24.77 | v69.22,18.41 70.48,18.41 75.56,13.34 IC1.CANRX
  Bottom 0.406: v71.75,24.77 71.75,20.95 v69.22,18.41
CANRX1  (via drill 0.9)
  Top 0.406: IC4.4 73.66,33.66 73.03,33.02 73.03,30.48 v71.75,29.21
  Bottom 0.406: v71.75,29.21 71.75,27.3 67.94,23.5 67.94,17.14 70.48,14.61 IC1.DAC0
CANTX0
  Top 0.406: IC3.1 71.93,18.24 74.93,15.24 76.83,15.24 78.11,13.97 IC1.CANTX
CANTX1  (via drill 0.9)
  Top 0.406: IC4.1 v76.83,29.84
  Bottom 0.406: v76.83,29.84 76.83,25.4 78.11,24.13 78.11,21.59 78.74,20.95 81.92,20.95 IC1.53
CE
  Top 0.254: 45.72,46.35 45.72,48.9 44.45,50.16 43.18,50.16 41.91,51.44 41.91,53.98 45.09,57.15
  Top 0.305: IC8.1 46.41,45.66 45.72,46.35 | 45.09,57.15 IC1.2
GND  (via drill 0.7)
  Top 0.61: IC8.4 v50.8,42.55
  Top 2.54: TB-12V.2 C10.-
  Bottom 0.61: TB1.3 56.52,43.18 55.24,41.91 52.07,41.91 51.44,42.55 v50.8,42.55
  Bottom 1.27: IC2.2 C16.2 | C9.2 27.3,4.45 C11.2 IC1.GND_1 | SJ1.1 TB-12V.2
  pour Top (isolate 0.406): 2.54,78.11 89.53,78.11 90.81,79.38 90.81,91.44 92.08,92.71 99.06,92.71 99.69,92.08 99.69,9.53 98.42,8.26 94.61,8.26 92.71,6.35 92.71,1.91 91.44,0.64 10.79,0.64 8.89,2.54 8.89,5.71 5.71,8.89 2.54,8.89 0.64,10.79 0.64,76.83 1.91,78.11
GNDI
  Top 0.61: O1.2 42.55,74.3 36.83,80.01 36.83,86.36 39.37,88.9 R21.P$2
  Bottom 0.406: O2.2 36.2,71.75
  Bottom 0.61: O3.2 29.84,73.03 31.11,71.75 36.2,71.75 41.91,71.75 42.55,72.39 O1.2
  Bottom 1.27: SJ1.2 13.97,90.17 15.24,88.9 15.88,88.9
  Bottom 2.54: 15.88,88.9 34.92,88.9 36.2,90.17 36.2,95.25 J-BRAKE.2
  pour Bottom: 34.29,99.69 34.29,91.44 38.73,87 66.67,87 67.31,87.63 67.31,99.06 66.67,99.69
IN1
  Bottom 0.406: R2.P$1 TB5.1
IN2
  Bottom 0.406: R3.P$1 TB5.2
IN-BRAKE  (via drill 0.9)
  Top 0.406: v35.56,47.62 35.56,38.1 v34.92,37.47 | v39.37,29.84 v39.37,26.04
  Bottom 0.305: 44.07,16.89 50.42,16.89 52.7,14.61 54.61,14.61 55.24,13.97
  Bottom 0.406: O1.4 45.09,64.14 44.45,63.5 38.73,63.5 37.47,62.23 IC1.5 37.47,57.78 29.21,49.53 R4.P$1 33.66,49.53 v35.56,47.62 | v34.92,37.47 34.92,34.29 v39.37,29.84 | v39.37,26.04 39.37,19.05 41.53,16.89 44.07,16.89 | 55.24,13.97 IC1.A7
INPUT1
  Bottom 0.406: R5.P$1 29.84,52.7 34.92,57.78 IC1.6 34.92,62.87 35.56,63.5 36.2,63.5 O2.4
INPUT2
  Bottom 0.406: R6.P$1 30.48,55.88 32.38,57.78 IC1.7 O3.4
MISO
  Top 0.305: IC8.2 48.26,40.01 | 48.26,40.01 IC1.MISO_ICSP | 48.26,40.01 46.51,40.01 R26.1
MOSI
  Top 0.305: IC8.5 51.38,50.86 52.07,50.16 52.07,43.18 53.98,41.27 53.98,38.73 IC1.MOSI_ICSP
N$1
  Bottom 0.406: R16.P$2 69.85,90.17 67.94,88.27 67.94,85.09 67.31,84.45 Q1.G 60.96,84.45 60.33,83.82 R17.P$1
N$2
  Bottom 0.406: O3.1 25.4,80.64 R3.P$2
N$3
  Bottom 0.406: R2.P$2 21.59,85.09 22.23,85.72 26.67,85.72 27.94,84.45 27.94,80.01 32.38,75.56 38.1,75.56 38.73,74.93 O2.1
N$4
  Bottom 0.406: O1.1 45.09,74.3 42.55,76.83 33.02,76.83 31.11,78.74 R1.P$2
N$5
  Bottom 0.406: R8.P$1 R7.P$1 C1.1
N$6
  Bottom 0.406: R9.P$1 R10.P$1 57.78,41.27 C2.1
N$8
  Bottom 0.406: R27.P$1 36.2,6.35 34.29,8.26 34.29,13.97 31.11,17.14 19.05,17.14 J-AN3.2 16.51,22.86 18.41,24.77 R28.P$2
N$9
  Top 0.406: IC4.7 70.48,31.11 71.75,32.38 71.75,36.83 72.39,37.47 72.39,40.64 71.75,41.27 R10.P$2
  Bottom 0.406: R10.P$2 67.31,41.27 64.14,44.45 TB1.1
N$10
  Top 0.406: IC4.6 70.48,32.38 71.12,33.02 71.12,37.47 R9.P$2
  Bottom 0.406: TB1.2 68.58,38.1 R9.P$2
N$11
  Bottom 0.406: R18.P$2 69.22,87 68.58,86.36 68.58,83.19 66.67,81.28 61.59,81.28 60.96,80.64 59.69,80.64 55.88,84.45 Q2.G 50.16,84.45 49.53,83.82 R19.P$1
N$12
  Bottom 0.406: R20.P$2 70.48,83.82 66.67,80.01 45.72,80.01 44.45,81.28 Q3.G 40.64,84.45 39.37,83.19 R21.P$1
N$13
  Bottom 0.406: O4.1 91.44,84.45 91.44,62.23 89.53,60.33 R13.P$2
N$14
  Bottom 0.406: O5.1 92.71,79.38 R14.P$2
N$15
  Bottom 0.406: R15.P$2 95.89,69.85 94.61,71.12 O6.1
N$16
  Bottom 0.406: R20.P$1 81.92,82.55 O6.3
N$17
  Bottom 0.406: R18.P$1 83.82,87 O5.3
N$18
  Bottom 0.406: R16.P$1 O4.3
N$19
  Bottom 1.27: TB-12V.1 8.89,96.52 D5.A
N$20
  Bottom 0.406: TP1.1 IC1.A3
N$21
  Bottom 0.406: TP1.2 IC1.A4
OP1
  Top 1.27: TB6.1 56.52,92.71 62.23,87 Q1.D
OP2
  Top 1.27: TB6.2 60.33,97.79 59.05,99.06 54.61,99.06 53.34,97.79 53.34,92.08 50.8,89.53 50.8,88.27 52.07,87 Q2.D
OP3
  Top 1.27: TB7.1 43.18,92.71 41.27,90.81 41.27,87.63 41.91,87 Q3.D
OUT1
  Bottom 0.406: IC1.48 81.92,26.04 88.9,26.04 89.53,26.67 R13.P$1
OUT2
  Bottom 0.406: IC1.49 92.08,24.77 92.71,25.4 R14.P$1
OUT3
  Bottom 0.406: IC1.50 81.92,23.5 92.71,23.5 95.25,26.04 95.25,43.81 95.89,44.45 R15.P$1
PTCANH
  Top 0.406: J-LEAF.4 55.88,26.04 57.15,24.77 R8.P$2 57.15,19.05 57.78,18.41 60.33,18.41 62.87,20.95 IC3.7
PTCANL
  Top 0.406: IC3.6 60.33,22.23 | J-LEAF.5 55.24,27.3 57.78,27.3 58.42,26.67 58.42,22.86 59.05,22.23 60.33,22.23 | 60.33,22.23 R7.P$2
RX2
  Bottom 0.406: ESP8266.7 67.94,71.12 66.67,69.85 66.04,69.85 62.87,66.67 IC1.RX2
SCK  (via drill 0.7)
  Top 0.305: IC8.6 49.53,52.07 50.16,52.7 51.44,52.7 52.7,51.44 52.7,43.81 53.34,43.18 v53.98,43.18
  Bottom 0.305: v53.98,43.18 52.7,44.45 49.53,44.45 48.26,43.18 48.26,38.1 48.9,37.47 IC1.SCK_ICSP
SCL
  Top 0.406: IC7.6 71.75,54.61 72.39,53.98 73.66,53.98 74.3,54.61 74.3,59.05 IC1.SCL
  Bottom 0.406: LCD.4 IC1.SCL 73.03,58.42 67.94,53.34 R12.P$1
SDA
  Top 0.406: IC7.5 73.03,57.15 70.48,59.69 IC1.SDA
  Bottom 0.406: LCD.3 IC1.SDA 70.48,57.78 69.22,56.52 R11.P$1
THROTTLE1  (via drill 0.9)
  Top 0.406: v37.47,36.2 J-AN1.2
  Bottom 0.406: R22.P$1 v37.47,36.2
THROTTLE2  (via drill 0.9)
  Top 0.406: J-AN2.2 23.5,34.92 v24.13,34.29
  Bottom 0.406: v24.13,34.29 32.38,34.29 36.83,29.84 36.83,28.57 37.47,27.94 R24.P$1
TX2
  Bottom 0.406: ESP8266.5 65.41,71.12 60.33,66.04 IC1.TX2

### Text on the board
tPlace: www.evbmw.com | https://openinverter.org/forum/viewtopic.php?f=4&t=179 | Based on work of Damien McGuire | Mack-e- | LeafCan_V001